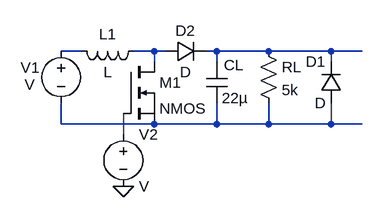
[diagram p0: schematic Draft1.asc]
Draft1.asc, the LTspice schematic file:
Version 4
SHEET 1 880 736
WIRE 144 512 112 512
WIRE 256 512 224 512
WIRE 272 512 256 512
WIRE 352 512 336 512
WIRE 432 512 352 512
WIRE 528 512 432 512
WIRE 576 512 528 512
WIRE 256 528 256 512
WIRE 352 528 352 512
WIRE 528 528 528 512
WIRE 112 624 112 592
WIRE 256 624 112 624
WIRE 352 624 352 592
WIRE 352 624 256 624
WIRE 432 624 432 592
WIRE 432 624 352 624
WIRE 528 624 528 592
WIRE 528 624 432 624
WIRE 576 624 528 624
WIRE 208 640 208 608
FLAG 208 720 0
SYMBOL Cap 336 528 R0
WINDOW 0 27 5 Left 2
SYMATTR InstName CL
SYMATTR Value 22µ
SYMBOL Res 416 496 R0
SYMATTR InstName RL
SYMATTR Value 5k
SYMBOL Diode 544 592 R180
WINDOW 0 24 64 Left 2
WINDOW 3 24 0 Left 2
SYMATTR InstName D1
SYMBOL Diode 272 528 R270
WINDOW 0 32 32 VTop 2
WINDOW 3 0 32 VBottom 2
SYMATTR InstName D2
SYMBOL Voltage 112 496 R0
WINDOW 0 -62 41 Left 2
WINDOW 3 -56 67 Left 2
SYMATTR InstName V1
SYMBOL ind 240 496 R90
WINDOW 0 5 56 VBottom 2
WINDOW 3 32 56 VTop 2
SYMATTR InstName L1
SYMBOL nmos 208 528 R0
SYMATTR InstName M1
SYMBOL Voltage 208 624 R0
SYMATTR InstName V2

The netlist it stands for:
* Draft1.asc
CL N003 N004 22µ
RL N003 N004 5k
D1 N004 N003 D
D2 N002 N003 D
V1 N001 N004 V
L1 N002 N001 L
M1 N002 N005 N004 N004 NMOS
V2 N005 0 V
.model D D
.lib standard.dio
.model NMOS NMOS
.model PMOS PMOS
.lib standard.mos
.backanno
.end